# Altium schematic sheet SwitchMultiControl.SchDoc
size A4
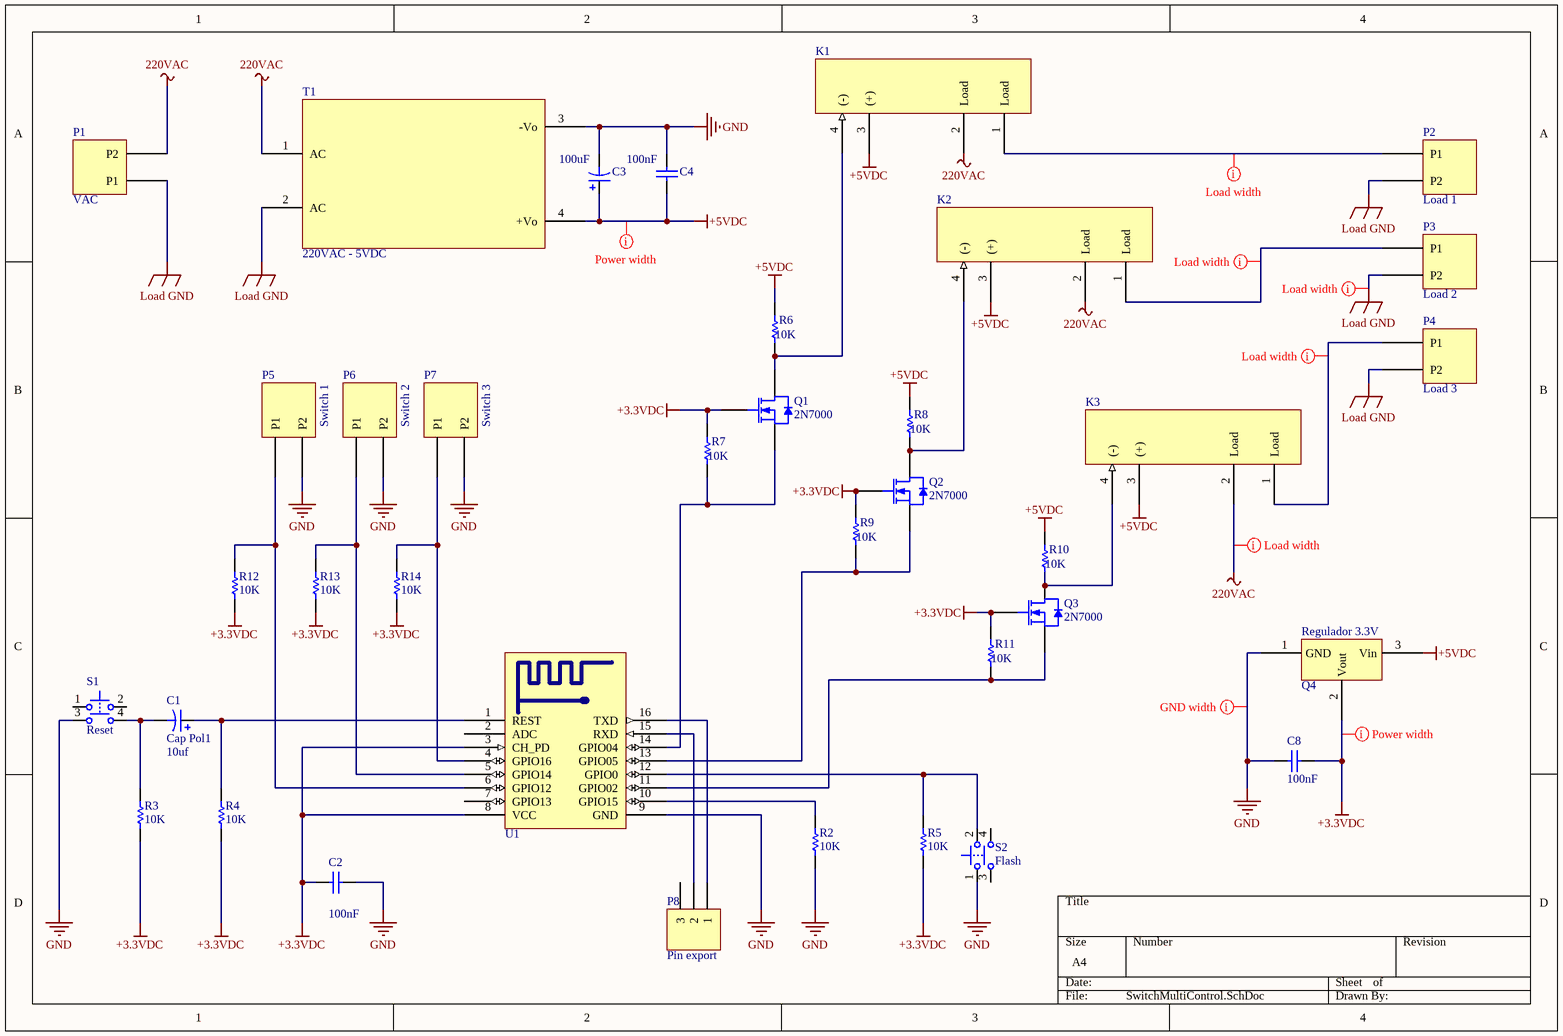
[diagram p0: SwitchMultiControl.SchDoc]

## Parts
C1  Cap Pol1  value 10uf  [RAD-0.1]
C2  value 100nF  [RAD-0.1]  (hidden comment: Cap)
C3  value 100uF  [RAD-0.1]  (hidden comment: Cap Pol1)
C4  value 100nF  [RAD-0.1]  (hidden comment: Cap)
C8  value 100nF  [RAD-0.1]  (hidden comment: Cap)
K1  G3MB-202P DC5  [G3MB-202P DC5]  (value not drawn)
K2  G3MB-202P DC5  [G3MB-202P DC5]  (value not drawn)
K3  G3MB-202P DC5  [G3MB-202P DC5]  (value not drawn)
P1  VAC  [ScrewTerminal-X2]
P2  Load 1  [ScrewTerminal-X2]
P3  Load 2  [ScrewTerminal-X2]
P4  Load 3  [ScrewTerminal-X2]
P5  Switch 1  [ScrewTerminal-X2]
P6  Switch 2  [ScrewTerminal-X2]
P7  Switch 3  [ScrewTerminal-X2]
P8  Pin export  [HDR1X3]
Q1  2N7000  [SOT54]
Q2  2N7000  [SOT54]
Q3  2N7000  [SOT54]
Q4  Regulador 3.3V  [TO-220-AB]
R2  value 10K  [AXIAL-0.3]  (hidden comment: Res1)
R3  value 10K  [AXIAL-0.3]  (hidden comment: Res1)
R4  value 10K  [AXIAL-0.3]  (hidden comment: Res1)
R5  value 10K  [AXIAL-0.3]  (hidden comment: Res1)
R6  value 10K  [AXIAL-0.3]  (hidden comment: Res1)
R7  value 10K  [AXIAL-0.3]  (hidden comment: Res1)
R8  value 10K  [AXIAL-0.3]  (hidden comment: Res1)
R9  value 10K  [AXIAL-0.3]  (hidden comment: Res1)
R10  value 10K  [AXIAL-0.3]  (hidden comment: Res1)
R11  value 10K  [AXIAL-0.3]  (hidden comment: Res1)
R12  value 10K  [AXIAL-0.3]  (hidden comment: Res1)
R13  value 10K  [AXIAL-0.3]  (hidden comment: Res1)
R14  value 10K  [AXIAL-0.3]  (hidden comment: Res1)
S1  Reset  [PushButton]
S2  Flash  [PushButton]
T1  220VAC - 5VDC  [HLK-PM]
U1  ESP-12  [ESP_12]  (value not drawn)

## Nets
220VAC: K1.2(Load) K2.2(Load) K3.2(Load) P1.2(P2) T1.1(AC)
+3.3VDC: C2.1 C8.2 Q1.2(G) Q2.2(G) Q3.2(G) Q4.2(Vout) R3.2 R4.2 R5.2 R7.2 R9.2 R11.2 R12.2 R13.2 R14.2 U1.3(CH_PD) U1.8(VCC)
+5VDC: C3.1 C4.2 K1.3((+)) K2.3((+)) K3.3((+)) Q4.3(Vin) R6.2 R8.2 R10.2 T1.4(+Vo)
GND: C2.2 C3.2 C4.1 C8.1 P5.2(P2) P6.2(P2) P7.2(P2) Q4.1(GND) R2.2 S1.3 S2.1 T1.3(-Vo) U1.9(GND)
Load GND: P1.1(P1) P2.2(P2) P3.2(P2) P4.2(P2) T1.2(AC)
NetC1_1: C1.1 R4.1 U1.1(REST)
NetC1_2: C1.2 R3.1 S1.4
NetK1_1: K1.1(Load) P2.1(P1)
NetK1_4: K1.4((-)) Q1.1(D) R6.1
NetK2_1: K2.1(Load) P3.1(P1)
NetK2_4: K2.4((-)) Q2.1(D) R8.1
NetK3_1: K3.1(Load) P4.1(P1)
NetK3_4: K3.4((-)) Q3.1(D) R10.1
NetP5_1: P5.1(P1) R12.1 U1.6(GPIO12)
NetP6_1: P6.1(P1) R13.1 U1.5(GPIO14)
NetP7_1: P7.1(P1) R14.1 U1.4(GPIO16)
NetP8_1: P8.1 U1.16(TXD)
NetP8_2: P8.2 U1.15(RXD)
NetQ1_3: Q1.3(S) R7.1 U1.14(GPIO04)
NetQ2_3: Q2.3(S) R9.1 U1.13(GPIO05)
NetQ3_3: Q3.3(S) R11.1 U1.11(GPIO02)
NetR2_1: R2.1 U1.10(GPIO15)
NetR5_1: R5.1 S2.2 U1.12(GPIO0)

Not connected (* = marked no-connect by the designer): P8 3; S1 1 2; S2 3 4; U1 2(ADC) 7(GPIO13)

## Layout directives
rule Width Constraint [Pref Width = 25mil    Min Width = 20mil    Max Width = 30mil]: GND
rule Width Constraint [Pref Width = 25mil    Min Width = 15mil    Max Width = 30mil]: +3.3VDC, +5VDC
rule Width Constraint [Pref Width = 85mil    Min Width = 70mil    Max Width = 90mil]: 220VAC, Load GND, NetK1_1, NetK2_1, NetK3_1

## Library data of the parts
C1 C3 = Cap Pol1: Polarized Capacitor (Radial); Published: 8-Jun-2000; LatestRevisionDate: 17-Jul-2002; LatestRevisionNote: Re-released for DXP Platform.; PackageReference: RB7.6-15; Publisher: Altium Limited; PackageDescription: Polarized Capacitor (Radial); 2 Leads
C2 C4 C8 = Cap: Capacitor; Published: 8-Jun-2000; LatestRevisionDate: 17-Jul-2002; LatestRevisionNote: Re-released for DXP Platform.; PackageReference: RAD-0.3; Publisher: Altium Limited; PackageDescription: Radial Cap, Thru-Hole; 2 Leads; 0.3 in Pin Spacing
K1-K3 = G3MB-202P DC5: RELAY MINI SSR 240VAC@2A ZERO; Mfr: Omron; Mfr PN: G3MB-202P DC5
P1-P7 = ScrewTerminal
P8 = Header 3: Header, 3-Pin; LatestRevisionDate: 17-Jul-2002; LatestRevisionNote: Re-released for DXP Platform.; Publisher: Altium Limited
Q1-Q3 = 2N7000: N-channel Enhancement Mode Field-effect Transistor; Published: 17-Sep-2003; LatestRevisionDate: 12-Dec-2006; LatestRevisionNote: Footprint pad sequence fixed.; DatasheetVersion: 19-May-2000; PackageVersion: Feb-1997; PackageReference: SOT54; Publisher: Altium Limited; PackageDescription: Plastic Single-Ended Leaded (through hole) package; 3 Leads (TO-92); Code_JEITA: SC-43; Code_JEDEC: TO-92; ComponentLink1Description: Manufacturer Link; ComponentLink1URL: http://www.semiconductors.philips.com/; ComponentLink2Description: Datasheet; ComponentLink2URL: http://www.semiconductors.philips.com/acrobat/datasheets/2N7000-03.pdf
Q4 = AMS1117
R2-R14 = Res1: Resistor; Published: 8-Jun-2000; LatestRevisionDate: 17-Jul-2002; LatestRevisionNote: Re-released for DXP Platform.; PackageReference: AXIAL-0.3; Publisher: Altium Limited; PackageDescription: Axial Device, Thru-Hole; 2 Leads; 0.3 in Pin Spacing
S1 S2 = IT-2175: Tactile Switch, DPST; Thru-Hole; Vertical; Rating DC 12V, 50mA (max); PackageDocument: Rev.0; Published: 6-Jun-2005; DatasheetDocument: Rev.0; PackageReference: IT-2175; Publisher: Altium Limited; ComponentLink1Description: Manufacturer Link; ComponentLink1URL: http://www.ilswitch.com/; ComponentLink2Description: Device Overview; ComponentLink2URL: http://www.ilswitch.com/list.php?ac_id=010112&ai_id=91
T1 = HLK-PM: HLK-PM*; Mfr: HLK-PM01